# Altium schematic sheet upper-pcb.SchDoc
size A; SheetNumber: 1; SheetTotal: 2
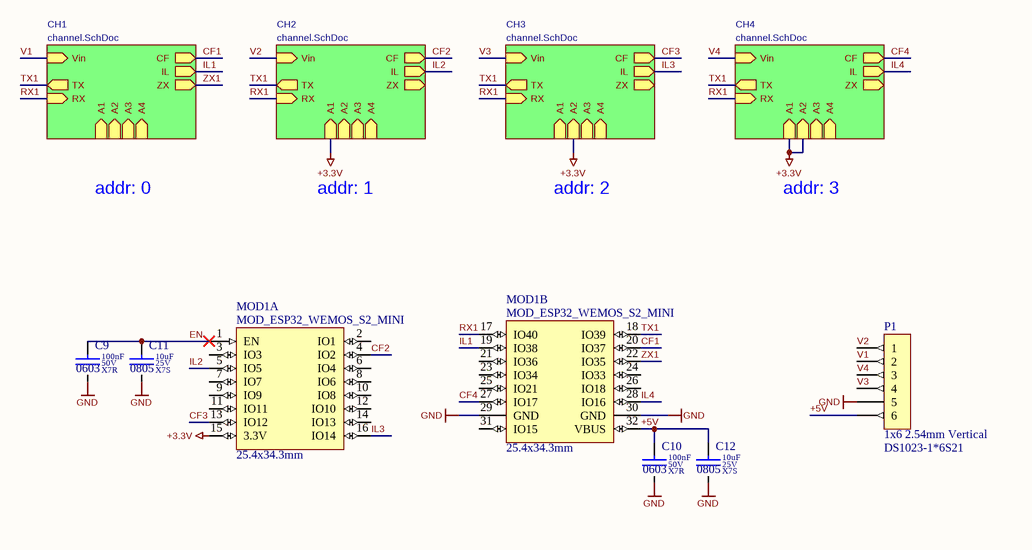
[diagram p0: upper-pcb.SchDoc]

## Parts
C9  value 100nF  Dielectric: X7R  Voltage: 50V  SCH_Footprint: 0603  [C_0603_1608]  (hidden comment: Ceramic X7R)
C10  value 100nF  Dielectric: X7R  Voltage: 50V  SCH_Footprint: 0603  [C_0603_1608]  (hidden comment: Ceramic X7R)
C11  value 10uF  Dielectric: X7S  Voltage: 25V  SCH_Footprint: 0805  [C_0805_2012]  (hidden comment: Ceramic X7S)
C12  value 10uF  Dielectric: X7S  Voltage: 25V  SCH_Footprint: 0805  [C_0805_2012]  (hidden comment: Ceramic X7S)
MOD1  value MOD_ESP32_WEMOS_S2_MINI  SCH_Footprint: 25.4x34.3mm  [MOD_ESP32_WEMOS_S2_MINI]  (hidden comment: ESP32-S2FN4R2 mini wifi board)  (parts A,B of 2)
P1  value DS1023-1*6S21  SCH_Footprint: 1x6 2.54mm Vertical  [J_HEADER_1x6_2.54_VERTICAL]  (hidden comment: Goldpin female straight)

## Sub-sheets
CH1 = channel.SchDoc: Vin (in), ZX (out), IL (out), CF (out), A1 (in), A2 (in), A3 (in), A4 (in), RX (in), TX (out)
CH2 = channel.SchDoc: Vin (in), ZX (out), IL (out), CF (out), A1 (in), A2 (in), A3 (in), A4 (in), RX (in), TX (out)
CH3 = channel.SchDoc: Vin (in), ZX (out), IL (out), CF (out), A1 (in), A2 (in), A3 (in), A4 (in), RX (in), TX (out)
CH4 = channel.SchDoc: Vin (in), ZX (out), IL (out), CF (out), A1 (in), A2 (in), A3 (in), A4 (in), RX (in), TX (out)

## Nets
+3.3V: MOD1.15(3.3V) ; sheet CH2/A1, sheet CH3/A2, sheet CH4/A1, sheet CH4/A2
GND: C9.2 C10.2 C11.2 C12.2 MOD1.29(GND) MOD1.30(GND) P1.5
+5V: C10.1 C12.1 MOD1.32(VBUS) P1.6
CF1: MOD1.20(IO37) ; sheet CH1/CF
CF2: MOD1.4(IO2) ; sheet CH2/CF
CF3: MOD1.13(IO12) ; sheet CH3/CF
CF4: MOD1.27(IO17) ; sheet CH4/CF
EN: C9.1 C11.1 MOD1.1(EN)
IL1: MOD1.19(IO38) ; sheet CH1/IL
IL2: MOD1.5(IO5) ; sheet CH2/IL
IL3: MOD1.16(IO14) ; sheet CH3/IL
IL4: MOD1.28(IO16) ; sheet CH4/IL
RX1: MOD1.17(IO40) ; sheet CH1/RX, sheet CH2/RX, sheet CH3/RX, sheet CH4/RX
TX1: MOD1.18(IO39) ; sheet CH1/TX, sheet CH2/TX, sheet CH3/TX, sheet CH4/TX
V1: P1.2 ; sheet CH1/Vin
V2: P1.1 ; sheet CH2/Vin
V3: P1.4 ; sheet CH3/Vin
V4: P1.3 ; sheet CH4/Vin
ZX1: MOD1.22(IO35) ; sheet CH1/ZX

Not connected (* = marked no-connect by the designer): MOD1 2(IO1) 3(IO3) 6(IO4) 7(IO7) 8(IO6) 9(IO9) 10(IO8) 11(IO11) 12(IO10) 14(IO13) 21(IO36) 23(IO34) 24(IO33) 25(IO21) 26(IO18) 31(IO15)

## Notes on the sheet
- addr: 0
- addr: 1
- addr: 2
- addr: 3

## Library data of the parts
C9 C10 = C_100nF_50V_X7R_0603_5: Capacitor; Manufacturer: Samsung; Manufacturer Part Number: CL10B104JB8NNNC; Tolerance (%): 5; Part Number: C_100nF_50V_X7R_0603_5; HelpURL: http://www.tme.eu/pl/Document/4a42202b32dab16128fe107dd69598cc/samsung-chip-cap.pdf; Supplier 1: TME; Supplier Part Number 1: CL10B104JB8NNNC; Supplier 2: RS Components; Supplier Part Number 2: 7665455; Supplier 3: Farnell; Supplier 4: Mouser; Supplier 5: Digi-Key; Supplier Part Number 5: 1276-1033-1-ND; Supplier 6: LCSC; Supplier Part Number 6: C24452
C11 C12 = C_10uF_25V_X7S_0805_10: Capacitor; Manufacturer: Murata; Manufacturer Part Number: GRT21BC71E106KE13L; Tolerance (%): 10; Part Number: C_10uF_25V_X7S_0805_10; HelpURL: https://eu.mouser.com/datasheet/2/281/1/GRT21BC71E106KE13_01A-3158174.pdf; Supplier 1: TME; Supplier Part Number 1: GRT21BC71E106KE13L; Supplier 2: RS Components; Supplier Part Number 2: 2478205; Supplier 3: Farnell; Supplier Part Number 3: 3790456; Supplier 4: Mouser; Supplier Part Number 4: 81-GRT21BC71E106KE13; Supplier 5: Digi-Key; Supplier Part Number 5: 490-GRT21BC71E106KE13LCT-ND; Supplier 6: LCSC
MOD1 = MOD_ESP32_WEMOS_S2_MINI: Manufacturer: Wemos; Part Number: MOD_ESP32_WEMOS_S2_MINI; HelpURL: https://www.wemos.cc/en/latest/s2/s2_mini.html; Manufacturer Part Number: MOD_ESP32_WEMOS_S2_MINI; Supplier 1: TME; Supplier 2: RS Components; Supplier 3: Farnell; Supplier 4: Mouser; Supplier 5: Digi-Key; Supplier 6: LCSC; Supplier 7: Aliexpress; Supplier Part Number 7: https://pl.aliexpress.com/item/1005003145192016.html
P1 = J_HEADER_1x6_2.54_VERTICAL: Pin Header; Manufacturer: Connfly; Part Number: J_HEADER_1x6_2.54_VERTICAL; HelpURL: https://www.tme.eu/Document/584b1a60cf2e8809a936c5f5ff2de0d5/zl262-sg.pdf; Manufacturer Part Number: DS1023-1*6S21; Supplier 1: TME; Supplier Part Number 1: ZL262-6SG; Supplier 2: RS Components; Supplier 3: Farnell; Supplier 4: Mouser; Supplier 5: Digi-Key; Supplier 6: LCSC